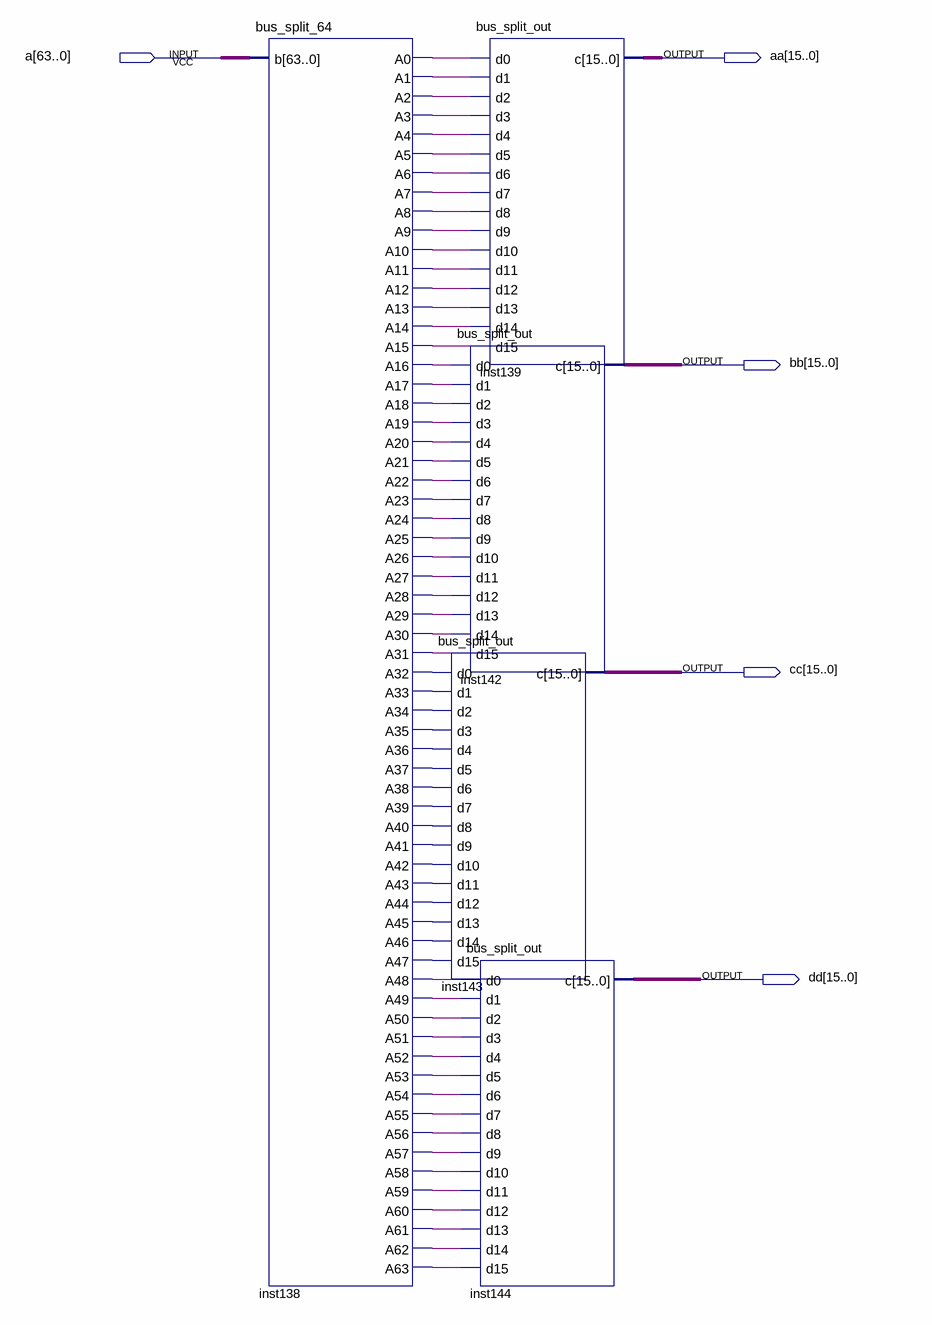
[diagram p0: schematic sheet]
// Quartus schematic bus64_split_out.bdf as structural Verilog: 5 symbols, 5 pins
module bus64_split_out (
  input  [63:0] a,
  output [15:0] aa,
  output [15:0] bb,
  output [15:0] cc,
  output [15:0] dd
);

  wire inst138_a0, inst138_a1, inst138_a2, inst138_a3, inst138_a4, inst138_a5, inst138_a6, inst138_a7,
       inst138_a8, inst138_a9, inst138_a10, inst138_a11, inst138_a12, inst138_a13, inst138_a14, inst138_a15,
       inst138_a16, inst138_a17, inst138_a18, inst138_a19, inst138_a20, inst138_a21, inst138_a22,
       inst138_a23, inst138_a24, inst138_a25, inst138_a26, inst138_a27, inst138_a28, inst138_a29,
       inst138_a30, inst138_a31, inst138_a32, inst138_a33, inst138_a34, inst138_a35, inst138_a36,
       inst138_a37, inst138_a38, inst138_a39, inst138_a40, inst138_a41, inst138_a42, inst138_a43,
       inst138_a44, inst138_a45, inst138_a46, inst138_a47, inst138_a48, inst138_a49, inst138_a50,
       inst138_a51, inst138_a52, inst138_a53, inst138_a54, inst138_a55, inst138_a56, inst138_a57,
       inst138_a58, inst138_a59, inst138_a60, inst138_a61, inst138_a62, inst138_a63;

  bus_split_64 inst138 (
    .b(a), .A0(inst138_a0), .A1(inst138_a1), .A2(inst138_a2), .A3(inst138_a3), .A4(inst138_a4),
    .A5(inst138_a5), .A6(inst138_a6), .A7(inst138_a7), .A8(inst138_a8), .A9(inst138_a9), .A10(inst138_a10),
    .A11(inst138_a11), .A12(inst138_a12), .A13(inst138_a13), .A14(inst138_a14), .A15(inst138_a15),
    .A16(inst138_a16), .A17(inst138_a17), .A18(inst138_a18), .A19(inst138_a19), .A20(inst138_a20),
    .A21(inst138_a21), .A22(inst138_a22), .A23(inst138_a23), .A24(inst138_a24), .A25(inst138_a25),
    .A26(inst138_a26), .A27(inst138_a27), .A28(inst138_a28), .A29(inst138_a29), .A30(inst138_a30),
    .A31(inst138_a31), .A32(inst138_a32), .A33(inst138_a33), .A34(inst138_a34), .A35(inst138_a35),
    .A36(inst138_a36), .A37(inst138_a37), .A38(inst138_a38), .A39(inst138_a39), .A40(inst138_a40),
    .A41(inst138_a41), .A42(inst138_a42), .A43(inst138_a43), .A44(inst138_a44), .A45(inst138_a45),
    .A46(inst138_a46), .A47(inst138_a47), .A48(inst138_a48), .A49(inst138_a49), .A50(inst138_a50),
    .A51(inst138_a51), .A52(inst138_a52), .A53(inst138_a53), .A54(inst138_a54), .A55(inst138_a55),
    .A56(inst138_a56), .A57(inst138_a57), .A58(inst138_a58), .A59(inst138_a59), .A60(inst138_a60),
    .A61(inst138_a61), .A62(inst138_a62), .A63(inst138_a63));
  bus_split_out inst139 (
    .d0(inst138_a0), .d1(inst138_a1), .d2(inst138_a2), .d3(inst138_a3), .d4(inst138_a4), .d5(inst138_a5),
    .d6(inst138_a6), .d7(inst138_a7), .d8(inst138_a8), .d9(inst138_a9), .d10(inst138_a10), .d11(inst138_a11),
    .d12(inst138_a12), .d13(inst138_a13), .d14(inst138_a14), .d15(inst138_a15), .c(aa));
  bus_split_out inst142 (
    .d0(inst138_a16), .d1(inst138_a17), .d2(inst138_a18), .d3(inst138_a19), .d4(inst138_a20),
    .d5(inst138_a21), .d6(inst138_a22), .d7(inst138_a23), .d8(inst138_a24), .d9(inst138_a25),
    .d10(inst138_a26), .d11(inst138_a27), .d12(inst138_a28), .d13(inst138_a29), .d14(inst138_a30),
    .d15(inst138_a31), .c(bb));
  bus_split_out inst143 (
    .d0(inst138_a32), .d1(inst138_a33), .d2(inst138_a34), .d3(inst138_a35), .d4(inst138_a36),
    .d5(inst138_a37), .d6(inst138_a38), .d7(inst138_a39), .d8(inst138_a40), .d9(inst138_a41),
    .d10(inst138_a42), .d11(inst138_a43), .d12(inst138_a44), .d13(inst138_a45), .d14(inst138_a46),
    .d15(inst138_a47), .c(cc));
  bus_split_out inst144 (
    .d0(inst138_a48), .d1(inst138_a49), .d2(inst138_a50), .d3(inst138_a51), .d4(inst138_a52),
    .d5(inst138_a53), .d6(inst138_a54), .d7(inst138_a55), .d8(inst138_a56), .d9(inst138_a57),
    .d10(inst138_a58), .d11(inst138_a59), .d12(inst138_a60), .d13(inst138_a61), .d14(inst138_a62),
    .d15(inst138_a63), .c(dd));
endmodule
